# Altium schematic sheet Power Outputs.SchDoc
size A4; SheetNumber: 6; SheetTotal: 7
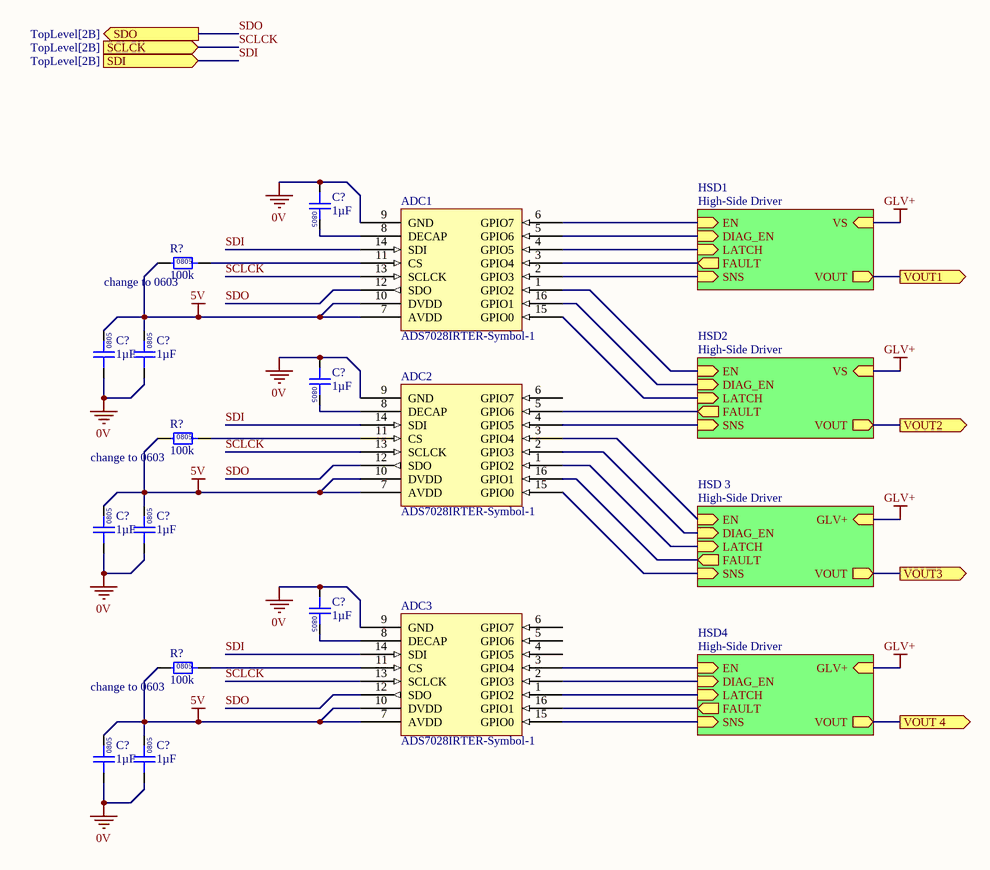
[diagram p0: Power Outputs.SchDoc]

## Parts
(Parts that share a designator on the sheet are numbered #1, #2 ... from top to bottom, then left to right.)
ADC1  ADS7028IRTER-Symbol-1  [WFQN-16]
ADC2  ADS7028IRTER-Symbol-1  [WFQN-16]
ADC3  ADS7028IRTER-Symbol-1  [WFQN-16]
C?#1  1µF  [0805]
C?#2  1µF  [0805]
C?#3  1µF  [0805]
C?#4  1µF  [0805]
C?#5  1µF  [0805]
C?#6  1µF  [0805]
C?#7  1µF  [0805]
C?#8  1µF  [0805]
C?#9  1µF  [0805]
R?#1  100k  [0805]
R?#2  100k  [0805]
R?#3  100k  [0805]

## Sub-sheets
HSD1 = High-Side Driver: VS (in), EN (in), DIAG_EN (in), LATCH (in), FAULT (out), SNS (in), VOUT (out)
HSD2 = High-Side Driver: VS (in), EN (in), DIAG_EN (in), LATCH (in), FAULT (out), SNS (in), VOUT (out)
HSD4 = High-Side Driver: GLV+ (in), EN (in), DIAG_EN (in), LATCH (in), FAULT (out), SNS (in), VOUT (out)
HSD 3 = High-Side Driver: GLV+ (in), EN (in), DIAG_EN (in), LATCH (in), FAULT (out), SNS (in), VOUT (out)

## Ports
SCLCK (in, see TopLevel[2B]), SDI (in, see TopLevel[2B]), SDO (out, see TopLevel[2B]), VOUT1 (out), VOUT2 (out), VOUT3 (out), VOUT 4 (out)

## Nets
0V: ADC1.9(GND) ADC2.9(GND) ADC3.9(GND) C?#1.1 C?#2.1 C?#3.1 C?#4.1 C?#5.1 C?#6.1 C?#7.1 C?#8.1 C?#9.1
5V: ADC1.7(AVDD) ADC1.10(DVDD) ADC2.7(AVDD) ADC2.10(DVDD) ADC3.7(AVDD) ADC3.10(DVDD) C?#2.2 C?#3.2 C?#5.2 C?#6.2 C?#8.2 C?#9.2 R?#1.1 R?#2.1 R?#3.1
GLV+: sheet HSD1/VS, sheet HSD2/VS, sheet HSD 3/GLV+, sheet HSD4/GLV+
SCLCK: ADC1.13(SCLCK) ADC2.13(SCLCK) ADC3.13(SCLCK) ; port SCLCK
SDI: ADC1.14(SDI) ADC2.14(SDI) ADC3.14(SDI) ; port SDI
SDO: ADC1.12(SDO) ADC2.12(SDO) ADC3.12(SDO) ; port SDO
VOUT1: port VOUT1, sheet HSD1/VOUT
VOUT2: port VOUT2, sheet HSD2/VOUT
VOUT3: port VOUT3, sheet HSD 3/VOUT
VOUT 4: port VOUT 4, sheet HSD4/VOUT
NetADC1_1: ADC1.1(GPIO2) ; sheet HSD2/EN
NetADC1_2: ADC1.2(GPIO3) ; sheet HSD1/SNS
NetADC1_3: ADC1.3(GPIO4) ; sheet HSD1/FAULT
NetADC1_4: ADC1.4(GPIO5) ; sheet HSD1/LATCH
NetADC1_5: ADC1.5(GPIO6) ; sheet HSD1/DIAG_EN
NetADC1_6: ADC1.6(GPIO7) ; sheet HSD1/EN
NetADC1_8: ADC1.8(DECAP) C?#1.2
NetADC1_11: ADC1.11(CS) R?#1.2
NetADC1_15: ADC1.15(GPIO0) ; sheet HSD2/LATCH
NetADC1_16: ADC1.16(GPIO1) ; sheet HSD2/DIAG_EN
NetADC2_1: ADC2.1(GPIO2) ; sheet HSD 3/LATCH
NetADC2_2: ADC2.2(GPIO3) ; sheet HSD 3/DIAG_EN
NetADC2_3: ADC2.3(GPIO4) ; sheet HSD 3/EN
NetADC2_4: ADC2.4(GPIO5) ; sheet HSD2/SNS
NetADC2_5: ADC2.5(GPIO6) ; sheet HSD2/FAULT
NetADC2_8: ADC2.8(DECAP) C?#4.2
NetADC2_11: ADC2.11(CS) R?#2.2
NetADC2_15: ADC2.15(GPIO0) ; sheet HSD 3/SNS
NetADC2_16: ADC2.16(GPIO1) ; sheet HSD 3/FAULT
NetADC3_1: ADC3.1(GPIO2) ; sheet HSD4/LATCH
NetADC3_2: ADC3.2(GPIO3) ; sheet HSD4/DIAG_EN
NetADC3_3: ADC3.3(GPIO4) ; sheet HSD4/EN
NetADC3_8: ADC3.8(DECAP) C?#7.2
NetADC3_11: ADC3.11(CS) R?#3.2
NetADC3_15: ADC3.15(GPIO0) ; sheet HSD4/SNS
NetADC3_16: ADC3.16(GPIO1) ; sheet HSD4/FAULT

Not connected (* = marked no-connect by the designer): ADC2 6(GPIO7); ADC3 4(GPIO5) 5(GPIO6) 6(GPIO7)

## Notes on the sheet
- (near R?#1) change to 0603
- (near R?#2) change to 0603
- (near R?#3) change to 0603
- (in symbol GCM21BR71H105KA03L) 0805
- (in symbol RC0805FR07100KL) 0805

## Library data of the parts
ADC1-ADC3 = ADS7028IRTER: IC ADC 12BIT SAR 16WQFN; Manufacturer: Texas Instruments; Complex IC: 1; Part Number: ADS7028IRTER; Digikey Part Number: ADS7028IRTER; Digikey Link: https://www.digikey.com.au/en/products/detail/texas-instruments/ADS7028IRTER/12696020?s=N4IgTCBcDaIIIBEDKB2ADGAHASQEoBUBRXEAXQF8g
C?#1-C?#9 = GCM21BR71H105KA03L: Manufacturer: muRata; Rated Voltage: 50V; Tolerance: ±10%; Material: MLCC; Temperature Rating: X7R; Part Number: GCM21BR71H105KA03L; Value: 1µF; Digikey Part Number: 490-10675-1-ND
R?#1-R?#3 = RC0805FR07100KL: Manufacturer: YAGEO; Tolerance: 0.01; Rated Power: 0.125W; Part Number: RC0805FR07100KL; Value: 100k; Material: FR-07; Digikey Part Number: 311-100KCRCT-ND